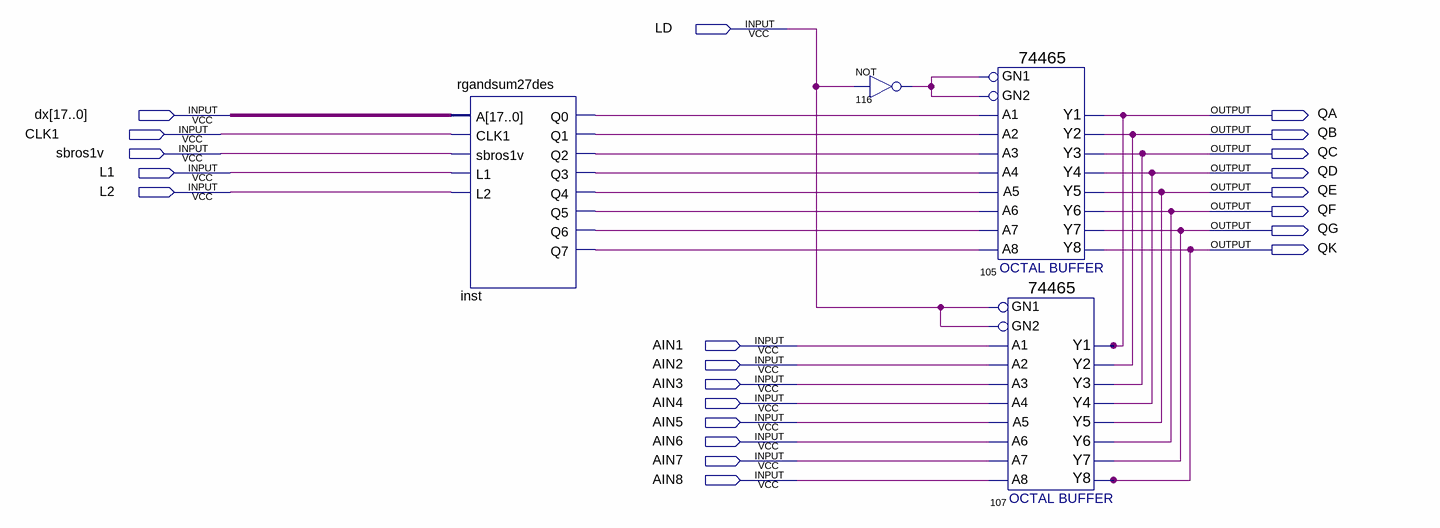
[diagram p0: schematic sheet]
// Quartus schematic summa17june27des.bdf as structural Verilog: 4 symbols, 22 pins
module summa17june27des (
  input  LD,
  input  [17:0] dx,
  input  CLK1,
  input  sbros1v,
  input  L1,
  input  L2,
  input  AIN1,
  input  AIN2,
  input  AIN3,
  input  AIN4,
  input  AIN5,
  input  AIN6,
  input  AIN7,
  input  AIN8,
  output QA,
  output QB,
  output QC,
  output QD,
  output QE,
  output QF,
  output QG,
  output QK
);

  wire inst_q0, inst_q1, inst_q2, inst_q3, inst_q4, inst_q5, inst_q6, inst_q7, n116_out;

  rgandsum27des inst (
    .A(dx), .CLK1(CLK1), .sbros1v(sbros1v), .L1(L1), .L2(L2), .Q0(inst_q0), .Q1(inst_q1), .Q2(inst_q2),
    .Q3(inst_q3), .Q4(inst_q4), .Q5(inst_q5), .Q6(inst_q6), .Q7(inst_q7));
  not u_116 (n116_out, LD);
  \74465  u_105 (
    .GN1(n116_out), .GN2(n116_out), .A1(inst_q0), .A2(inst_q1), .A3(inst_q2), .A4(inst_q3), .A6(inst_q5),
    .A7(inst_q6), .A8(inst_q7), .A5(inst_q4), .Y1(QA), .Y3(QC), .Y4(QD), .Y5(QE), .Y2(QB), .Y7(QG), .Y6(QF),
    .Y8(QK));
  \74465  u_107 (
    .GN1(LD), .GN2(LD), .A1(AIN1), .A2(AIN2), .A3(AIN3), .A4(AIN4), .A6(AIN6), .A7(AIN7), .A8(AIN8),
    .A5(AIN5), .Y1(QA), .Y3(QC), .Y4(QD), .Y5(QE), .Y2(QB), .Y7(QG), .Y6(QF), .Y8(QK));
endmodule
